# Altium schematic sheet S7CAS-PLEIADES-CARTE-MERE_Pxx_PHY.SchDoc
size Tabloid; SheetNumber: 9; SheetTotal: 17; Sheet_Name: PHY; Size: 11x17
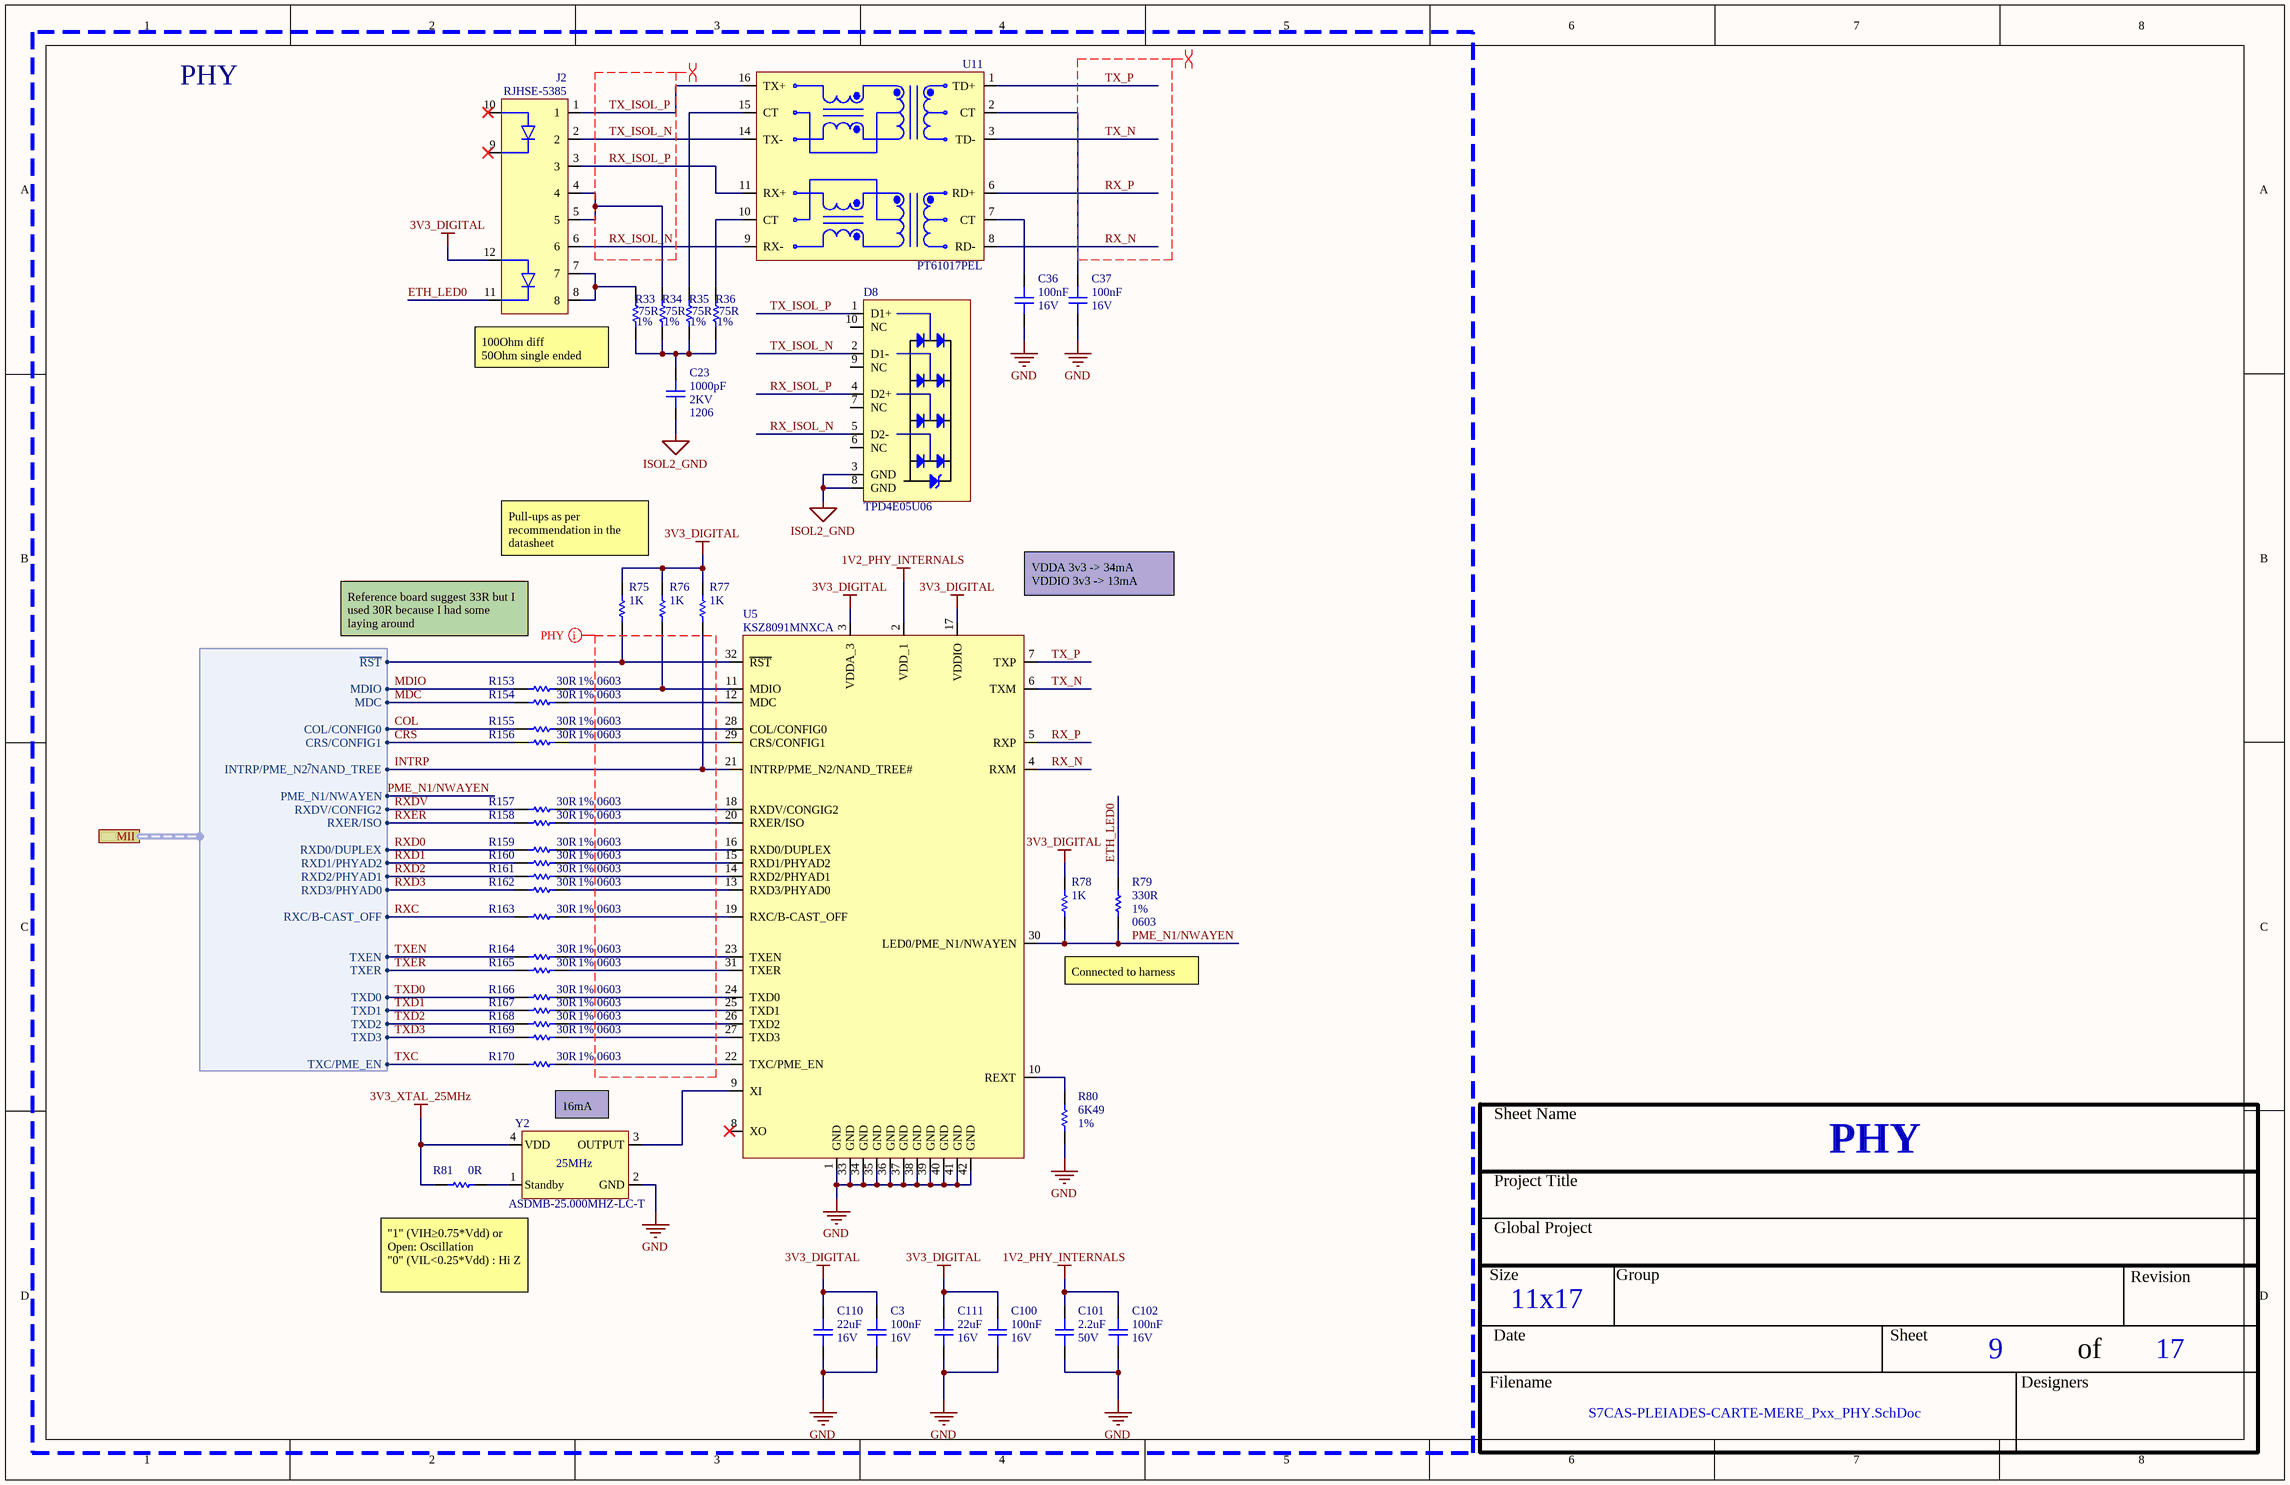
[diagram p0: S7CAS-PLEIADES-CARTE-MERE_Pxx_PHY.SchDoc]

## Parts
C3  value 100nF  Voltage: 16V  [CAP_0603]  (hidden comment: CAP - 0603)
C23  value 1000pF  Voltage: 2KV  Package: 1206  [CAP_1206]  (hidden comment: CAP - 1206)
C36  value 100nF  Voltage: 16V  [CAP_0603]  (hidden comment: CAP - 0603)
C37  value 100nF  Voltage: 16V  [CAP_0603]  (hidden comment: CAP - 0603)
C100  value 100nF  Voltage: 16V  [CAP_0603]  (hidden comment: CAP - 0603)
C101  value 2.2uF  Voltage: 50V  [CAP_0603]  (hidden comment: CAP - 0603)
C102  value 100nF  Voltage: 16V  [CAP_0603]  (hidden comment: CAP - 0603)
C110  value 22uF  Voltage: 16V  [CAP_1206]  (hidden comment: CAP - 1206)
C111  value 22uF  Voltage: 16V  [CAP_1206]  (hidden comment: CAP - 1206)
D8  TPD4E05U06  [TVS_DATA_TPD4E05U06]
J2  RJHSE-5385  [CONN_ETHERNET_RJHSE-5385]
R33  value 75R  Precision: 1%  [RES_0603]  (hidden comment: RES - 0603)
R34  value 75R  Precision: 1%  [RES_0603]  (hidden comment: RES - 0603)
R35  value 75R  Precision: 1%  [RES_0603]  (hidden comment: RES - 0603)
R36  value 75R  Precision: 1%  [RES_0603]  (hidden comment: RES - 0603)
R75  value 1K  [RES_0603]  (hidden comment: RES - 0603)
R76  value 1K  [RES_0603]  (hidden comment: RES - 0603)
R77  value 1K  [RES_0603]  (hidden comment: RES - 0603)
R78  value 1K  [RES_0603]  (hidden comment: RES - 0603)
R79  value 330R  Package: 0603  Precision: 1%  [RES_0603]  (hidden comment: RES - 0603)
R80  value 6K49  Precision: 1%  [RES_0402]  (hidden comment: RES - 0402)
R81  value 0R  [RES_0603]  (hidden comment: RES - 0603)
R153  value 30R  Package: 0603  Precision: 1%  [RES_0603]  (hidden comment: RES - 0603)
R154  value 30R  Package: 0603  Precision: 1%  [RES_0603]  (hidden comment: RES - 0603)
R155  value 30R  Package: 0603  Precision: 1%  [RES_0603]  (hidden comment: RES - 0603)
R156  value 30R  Package: 0603  Precision: 1%  [RES_0603]  (hidden comment: RES - 0603)
R157  value 30R  Package: 0603  Precision: 1%  [RES_0603]  (hidden comment: RES - 0603)
R158  value 30R  Package: 0603  Precision: 1%  [RES_0603]  (hidden comment: RES - 0603)
R159  value 30R  Package: 0603  Precision: 1%  [RES_0603]  (hidden comment: RES - 0603)
R160  value 30R  Package: 0603  Precision: 1%  [RES_0603]  (hidden comment: RES - 0603)
R161  value 30R  Package: 0603  Precision: 1%  [RES_0603]  (hidden comment: RES - 0603)
R162  value 30R  Package: 0603  Precision: 1%  [RES_0603]  (hidden comment: RES - 0603)
R163  value 30R  Package: 0603  Precision: 1%  [RES_0603]  (hidden comment: RES - 0603)
R164  value 30R  Package: 0603  Precision: 1%  [RES_0603]  (hidden comment: RES - 0603)
R165  value 30R  Package: 0603  Precision: 1%  [RES_0603]  (hidden comment: RES - 0603)
R166  value 30R  Package: 0603  Precision: 1%  [RES_0603]  (hidden comment: RES - 0603)
R167  value 30R  Package: 0603  Precision: 1%  [RES_0603]  (hidden comment: RES - 0603)
R168  value 30R  Package: 0603  Precision: 1%  [RES_0603]  (hidden comment: RES - 0603)
R169  value 30R  Package: 0603  Precision: 1%  [RES_0603]  (hidden comment: RES - 0603)
R170  value 30R  Package: 0603  Precision: 1%  [RES_0603]  (hidden comment: RES - 0603)
U5  KSZ8091MNXCA  [COM_ETH_PHY_KSZ8091MNXCA]
U11  PT61017PEL  [ISO_PT61017PEL]
Y2  ASDMB-25.000MHZ-LC-T  [OSC_ASDMB-25.000MHZ-LC-T]

## Blocks framed on the sheet
PHY: C3 C23 C36 C37 C100-C102 C110 C111 D8 J2 R33-R36 R75-R81 R153-R170 U5 U11 Y2

## Ports
MII (harness MII - Harness, see S7CAS-PLEIADES-CARTE-MERE_Pxx_FPGA_bank0_1_5[1B])

## Harnesses
MII - Harness: ~{RST}, MDIO, MDC, COL/CONFIG0, CRS/CONFIG1, INTRP/PME_N2~{/}NAND_TREE, PME_N1/NWAYEN, RXDV/CONFIG2, RXER/ISO, RXD0/DUPLEX, RXD1/PHYAD2, RXD2/PHYAD1, RXD3/PHYAD0, RXC/B-CAST_OFF, TXEN, TXER, TXD0, TXD1, TXD2, TXD3, TXC/PME_EN

## Nets
1V2_PHY_INTERNALS: C101.2 C102.2 U5.2(VDD_1)
3V3_DIGITAL: C3.2 C100.2 C110.2 C111.2 J2.12(LED2_A) R75.2 R76.2 R77.2 R78.2 U5.3(VDDA_3) U5.17(VDDIO)
3V3_XTAL_25MHz: R81.2 Y2.4(VDD)
GND: C3.1 C36.1 C37.1 C100.1 C101.1 C102.1 C110.1 C111.1 R80.1 U5.1(GND) U5.33(GND) U5.34(GND) U5.35(GND) U5.36(GND) U5.37(GND) U5.38(GND) U5.39(GND) U5.40(GND) U5.41(GND) U5.42(GND) Y2.2(GND)
ISOL2_GND: C23.1 D8.3(GND) D8.8(GND)
COL: R155.1 ; port MII.COL/CONFIG0
CRS: R156.1 ; port MII.CRS/CONFIG1
ETH_LED0: J2.11(LED2_K) R79.2
INTRP: R77.1 U5.21(INTRP/PME_N2/NAND_TREE#) ; port MII.INTRP/PME_N2~{/}NAND_TREE
MDC: R154.1 ; port MII.MDC
MDIO: R153.1 ; port MII.MDIO
PME_N1/NWAYEN: R78.1 R79.1 U5.30(LED0/PME_N1/NWAYEN) ; port MII.PME_N1/NWAYEN
RX_ISOL_N: D8.5(D2-) J2.6 U11.9(RX-)
RX_ISOL_P: D8.4(D2+) J2.3 U11.11(RX+)
RX_N: U5.4(RXM) U11.8(RD-)
RX_P: U5.5(RXP) U11.6(RD+)
RXC: R163.1 ; port MII.RXC/B-CAST_OFF
RXD0: R159.1 ; port MII.RXD0/DUPLEX
RXD1: R160.1 ; port MII.RXD1/PHYAD2
RXD2: R161.1 ; port MII.RXD2/PHYAD1
RXD3: R162.1 ; port MII.RXD3/PHYAD0
RXDV: R157.1 ; port MII.RXDV/CONFIG2
RXER: R158.1 ; port MII.RXER/ISO
TX_ISOL_N: D8.2(D1-) J2.2 U11.14(TX-)
TX_ISOL_P: D8.1(D1+) J2.1 U11.16(TX+)
TX_N: U5.6(TXM) U11.3(TD-)
TX_P: U5.7(TXP) U11.1(TD+)
TXC: R170.1 ; port MII.TXC/PME_EN
TXD0: R166.1 ; port MII.TXD0
TXD1: R167.1 ; port MII.TXD1
TXD2: R168.1 ; port MII.TXD2
TXD3: R169.1 ; port MII.TXD3
TXEN: R164.1 ; port MII.TXEN
TXER: R165.1 ; port MII.TXER
NetC23_2: C23.2 R33.1 R34.1 R35.1 R36.1
NetC36_2: C36.2 U11.7(CT)
NetC37_2: C37.2 U11.2(CT)
NetJ2_4: J2.4 J2.5 R34.2
NetJ2_7: J2.7 J2.8 R33.2
NetR35_2: R35.2 U11.15(CT)
NetR36_2: R36.2 U11.10(CT)
NetR75_1: R75.1 U5.32(~{RST}) ; port MII.~{RST}
NetR76_1: R76.1 R153.2 U5.11(MDIO)
NetR80_2: R80.2 U5.10(REXT)
NetR81_1: R81.1 Y2.1(Standby)
NetR154_2: R154.2 U5.12(MDC)
NetR155_2: R155.2 U5.28(COL/CONFIG0)
NetR156_2: R156.2 U5.29(CRS/CONFIG1)
NetR157_2: R157.2 U5.18(RXDV/CONGIG2)
NetR158_2: R158.2 U5.20(RXER/ISO)
NetR159_2: R159.2 U5.16(RXD0/DUPLEX)
NetR160_2: R160.2 U5.15(RXD1/PHYAD2)
NetR161_2: R161.2 U5.14(RXD2/PHYAD1)
NetR162_2: R162.2 U5.13(RXD3/PHYAD0)
NetR163_2: R163.2 U5.19(RXC/B-CAST_OFF)
NetR164_2: R164.2 U5.23(TXEN)
NetR165_2: R165.2 U5.31(TXER)
NetR166_2: R166.2 U5.24(TXD0)
NetR167_2: R167.2 U5.25(TXD1)
NetR168_2: R168.2 U5.26(TXD2)
NetR169_2: R169.2 U5.27(TXD3)
NetR170_2: R170.2 U5.22(TXC/PME_EN)
NetU5_9: U5.9(XI) Y2.3(OUTPUT)

Not connected (* = marked no-connect by the designer): D8 6(NC) 7(NC) 9(NC) 10(NC); J2 9(LED1_K)* 10(LED1_A)*; U5 8(XO)*

## Layout directives
differential pair; differential pair class ETH_DIFF_PAIR: RX_N, RX_P, TX_N, TX_P
differential pair; differential pair class ETH_ISOL_DIFF_PAIR: RX_ISOL_N, RX_ISOL_P, TX_ISOL_N, TX_ISOL_P
net class MII_TRANSMISSION_LINE: (no net found under the mark)

## Notes on the sheet
- 100Ohm diff
  50Ohm single ended
- Pull-ups as per recommendation in the datasheet
- Reference board suggest 33R but I used 30R because I had some laying around
- (near U5) VDDA 3v3 -> 34mA
  VDDIO 3v3 -> 13mA
- Connected to harness
- 16mA
- "1" (VIH≥0.75*Vdd) or Open: Oscillation
  "0" (VIL<0.25*Vdd) : Hi Z
- Sheet Name
- Project Title
- Global Project
- Size
- Group
- Revision
- Date
- Sheet
- of
- Filename
- Designers

## Library data of the parts
C3 C36 C37 C100-C102 = CAP - 0603: Precision: 10%; Current: *; CreatedBy: Jonathan Bouchard; Power: *; Package: 0603; Supplier 1: Arrow Electronics
  C3 C36 C37 C100 C102: Supplier Part Number 1: CL10B104KO8NNNC
  C101: Supplier Part Number 1: GRM188R61H225KE11D
C23 C110 C111 = CAP - 1206: Precision: 10%; Current: *; CreatedBy: Jonathan Bouchard; Power: *; Supplier 1: Arrow Electronics
  C23: Supplier Part Number 1: 1206GC102KAT1A
  C110 C111: Package: 1206; Supplier Part Number 1: CL31A226MOCLNNC
D8 = TVS_DATA_TPD4E05U06: TVS - TVS DIODE 5.5VWM 14VC - 10SON; Manufacturer #1: Texas Instruments; Part Number #1: TPD4E05U06DQAR; Current Rating: 2.5A (8/20µs); Power Max: 40 W (peak); Value: 4 unidirectionnal channels; Voltage rating: 6V (Breakdown); Polarized: YES; Magnetic Material: UNKNOWN; GRAMS Lib Spec: 2.8; Manufacturer #2: *; Part Number #2: *; HelpURL: http://www.ti.com/lit/ds/symlink/tpd4e05u06.pdf; Supplier 1: Digi-Key; Supplier Part Number 1: 296-35765-1-ND; Note: *; Assembly Type: SMD; Temperature: -40°C ~ 125°C; Package: 10-USON; CreatedBy/Date: Olivier Bernard / 12/3/2018; Tolerance: *; VerifiedBy: Caroline Paulin / 4 juillet 2018; Cryo: UNKNOWN
J2 = CONN_ETHERNET_RJHSE-5385: CONN - MOD JACK RJ45 R/A ETHERNET - TH; Mfg: Amphenol; Voltage: *; Current: *; Power: *; Mfg Part Number: RJHSE-5385; HelpURL: https://www.amphenolcanada.com/ProductSearch/drawings/AC/RJHSE538X.pdf; CreatedBy: Jonathan Bouchard; Temperature: -55°C ~ 85°C; Value: *; Precision: *; Package: TH-12; Supplier 1: Digikey; Supplier Part Number 1: RJHSE-5385-ND
R75-R78 R81 = RES - 0603: Precision: 1%; Current: *; CreatedBy: Jonathan Bouchard; Package: 0603; Supplier 1: Arrow Electronics
  R75-R78: Supplier Part Number 1: RMCF0603FT1K00
  R81: Supplier Part Number 1: RMCF0603ZT0R00
R80 = RES - 0402: Voltage: 50V; Power: 1/16W; Current: *; CreatedBy: Jonathan Bouchard; Package: 0402; Supplier 1: Mouser; Supplier Part Number 1: 652-CR0402-FX6491GLF
U5 = COM_ETH_PHY_KSZ8091MNXCA: COM - ETHERNET PHY 10/100 - QFN-32; Voltage: 1.8V, 2.5V, 3.3V; Mfg: Micrel; Current: *; Power: *; Mfg Part Number: KSZ8091MNXCA; HelpURL: http://ww1.microchip.com/downloads/en/DeviceDoc/00002275A.pdf; CreatedBy: Jonathan Bouchard; Temperature: 0°C ~ 70°C; Value: *; Precision: *; Package: QFN-32; Supplier 1: Digikey; Supplier Part Number 1: 576-4356-ND
U11 = ISO_PT61017PEL: ISO - 350µH LAN 10/100 Base-T Pulse Transformer 1CT:1CT Surface Mount; GRAMS Lib Spec: 2.7; Supplier 1: Arrow Electronics; Supplier Part Number 1: PT61017PEL
Y2 = OSC_ASDMB-25.000MHZ-LC-T: OSC - 25MHz XO (Standard) LVCMOS - 4-SMD, No Lead; Manufacturer #1: Abracon LLC; Tolerance: ±50ppm; Voltage Rating: 1.8V ~ 3.3V; GRAMS Lib Spec: 2.8; Magnetic Material: Unknown; Polarized: Yes; Value: 25MHz; Current Rating: *; Power Max: *; HelpURL: https://abracon.com/Oscillators/ASDMB.pdf; CreatedBy/Date: Joël Lemay 2019-03-29; VerifiedBy: C. Paulin - 29 mai 2019; Temperature: -40°C ~ +85°C; Package: 4-SMD, No Lead; Manufacturer #2: *; Note: *; Assembly Type: SMD; Part Number #2: *; Part Number #1: ASDMB-25.000MHZ-LC-T; Supplier 1: Digi-Key; Supplier Part Number 1: 535-11730-1-ND; Cryo: UNKNOWN
R33-R36 R79 R153-R170 = RES - 0603: Current: *; CreatedBy: Jonathan Bouchard
  R33-R36: Package: 0603; Supplier 1: Arrow Electronics; Supplier Part Number 1: RMCF0603FT75R0
  R153-R170: Supplier 1: Arrow Electronics; Supplier Part Number 1: RMCF0603FT30R0